# Altium project iMX6_Pixhawk.PrjPcb (part 4 of 6)

## Sheet [14] - PWR 5V, 3V3, 2V5.SchDoc
size A2; DocumentNumber: 14; SheetNumber: 14; SheetTotal: 18
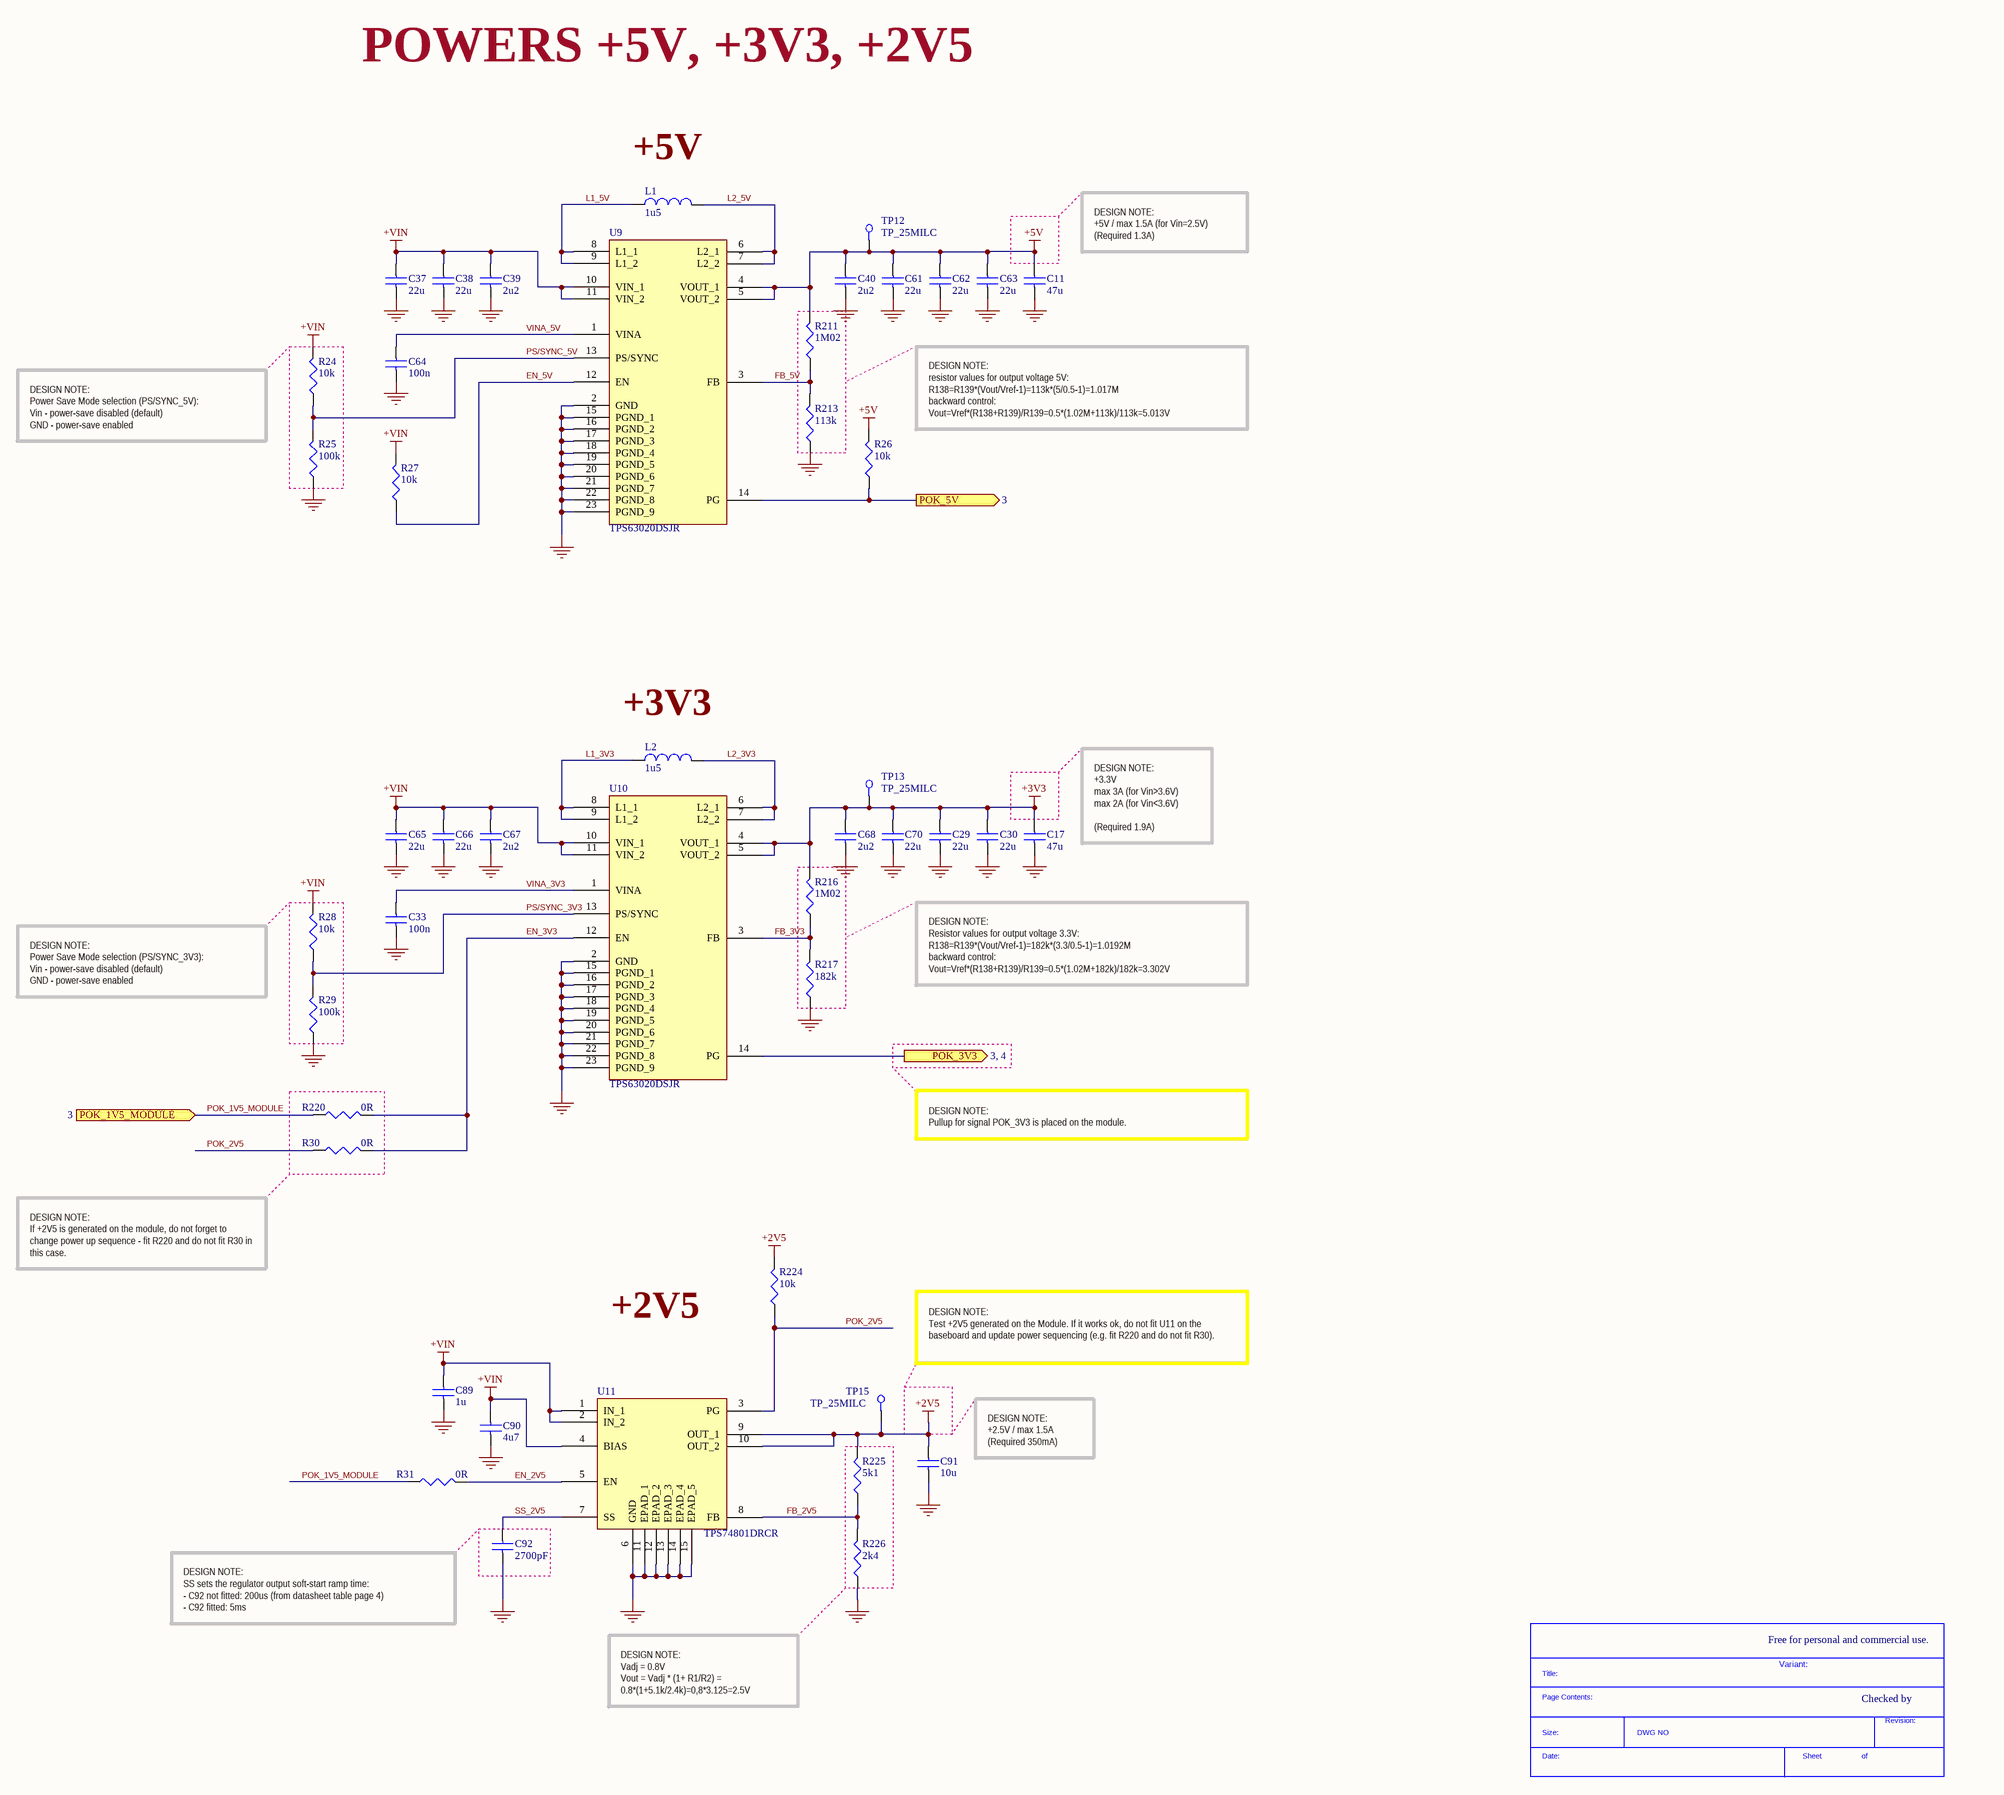
[diagram p16: [14] - PWR 5V, 3V3, 2V5.SchDoc]

### Parts
(Parts that share a designator on the sheet are numbered #1, #2 ... from top to bottom, then left to right.)
*#11  SDTitleBlock  (value not drawn)  (graphical)
C11  47u  [C0805]
C17  47u  [C0805]
C29  22u  [C0603]
C30  22u  [C0603]
C33  100n  [C0402]
C37  22u  [C0603]
C38  22u  [C0603]
C39  2u2  [C0402]
C40  2u2  [C0402]
C61  22u  [C0603]
C62  22u  [C0603]
C63  22u  [C0603]
C64  100n  [C0402]
C65  22u  [C0603]
C66  22u  [C0603]
C67  2u2  [C0402]
C68  2u2  [C0402]
C70  22u  [C0603]
C89  1u  [C0402]
C90  4u7  [C0402]
C91  10u  [C0603]
C92  2700pF  [C0402]
L1  1u5  [IHLP_204MILX216MIL]
L2  1u5  [IHLP_204MILX216MIL]
R24  10k  [R0402]
R25  100k  [R0402]
R26  10k  [R0402]
R27  10k  [R0402]
R28  10k  [R0402]
R29  100k  [R0402]
R30  0R  [R0402]
R31  0R  [R0402]
R211  1M02  [R0402]
R213  113k  [R0402]
R216  1M02  [R0402]
R217  182k  [R0402]
R220  0R  [R0402]
R224  10k  [R0402]
R225  5k1  [R0402]
R226  2k4  [R0402]
TP12  TP_25MILC  [TP_25C]  (no BOM)
TP13  TP_25MILC  [TP_25C]  (no BOM)
TP15  TP_25MILC  [TP_25C]  (no BOM)
U9  TPS63020DSJR  [DSJ (R-PVSON-N14)]
U10  TPS63020DSJR  [DSJ (R-PVSON-N14)]
U11  TPS74801DRCR  [DRC (S-PVSON-N10)]

### Ports
POK_1V5_MODULE (in, see 3), POK_3V3 (see 3, 4), POK_5V (out, see 3)

### Nets
+2V5: C91.1 R224.2 R225.2 TP15.1 U11.9(OUT_1) U11.10(OUT_2)
+3V3: C17.1 C29.1 C30.1 C68.1 C70.1 R216.2 TP13.1 U10.4(VOUT_1) U10.5(VOUT_2)
+5V: C11.1 C40.1 C61.1 C62.1 C63.1 R26.2 R211.2 TP12.1 U9.4(VOUT_1) U9.5(VOUT_2)
+VIN: C37.1 C38.1 C39.1 C65.1 C66.1 C67.1 C89.1 C90.1 R24.2 R27.2 R28.2 U9.10(VIN_1) U9.11(VIN_2) U10.10(VIN_1) U10.11(VIN_2) U11.1(IN_1) U11.2(IN_2) U11.4(BIAS)
GND: C11.2 C17.2 C29.2 C30.2 C33.2 C37.2 C38.2 C39.2 C40.2 C61.2 C62.2 C63.2 C64.2 C65.2 C66.2 C67.2 C68.2 C70.2 C89.2 C90.2 C91.2 C92.2 R25.1 R29.1 R213.1 R217.1 R226.1 U9.2(GND) U9.15(PGND_1) U9.16(PGND_2) U9.17(PGND_3) U9.18(PGND_4) U9.19(PGND_5) U9.20(PGND_6) U9.21(PGND_7) U9.22(PGND_8) U9.23(PGND_9) U10.2(GND) U10.15(PGND_1) U10.16(PGND_2) U10.17(PGND_3) U10.18(PGND_4) U10.19(PGND_5) U10.20(PGND_6) U10.21(PGND_7) U10.22(PGND_8) U10.23(PGND_9) U11.6(GND) U11.11(EPAD_1) U11.12(EPAD_2) U11.13(EPAD_3) U11.14(EPAD_4) U11.15(EPAD_5)
EN_2V5: R31.2 U11.5(EN)
EN_3V3: R30.2 R220.2 U10.12(EN)
EN_5V: R27.1 U9.12(EN)
FB_2V5: R225.1 R226.2 U11.8(FB)
FB_3V3: R216.1 R217.2 U10.3(FB)
FB_5V: R211.1 R213.2 U9.3(FB)
L1_3V3: L2.1 U10.8(L1_1) U10.9(L1_2)
L1_5V: L1.1 U9.8(L1_1) U9.9(L1_2)
L2_3V3: L2.2 U10.6(L2_1) U10.7(L2_2)
L2_5V: L1.2 U9.6(L2_1) U9.7(L2_2)
POK_1V5_MODULE: R31.1 R220.1 ; port POK_1V5_MODULE
POK_2V5: R30.1 R224.1 U11.3(PG)
PS/SYNC_3V3: R28.1 R29.2 U10.13(PS/SYNC)
PS/SYNC_5V: R24.1 R25.2 U9.13(PS/SYNC)
SS_2V5: C92.1 U11.7(SS)
VINA_3V3: C33.1 U10.1(VINA)
VINA_5V: C64.1 U9.1(VINA)
NetJ2_7: R26.1 U9.14(PG) ; port POK_5V
NetJ2_9: U10.14(PG) ; port POK_3V3

### Notes on the sheet
- POWERS +5V, +3V3, +2V5
- (near L1) +5V
- DESIGN NOTE:
  +5V / max 1.5A (for Vin=2.5V)
  (Required 1.3A)
- DESIGN NOTE:
  Power Save Mode selection (PS/SYNC_5V):
  Vin - power-save disabled (default)
  GND - power-save enabled
- DESIGN NOTE:
  resistor values for output voltage 5V:
  R138=R139*(Vout/Vref-1)=113k*(5/0.5-1)=1.017M
  backward control:
  Vout=Vref*(R138+R139)/R139=0.5*(1.02M+113k)/113k=5.013V
- (near L2) +3V3
- DESIGN NOTE:
  +3.3V
  max 3A (for Vin>3.6V)
  max 2A (for Vin<3.6V)
  (Required 1.9A)
- DESIGN NOTE:
  Power Save Mode selection (PS/SYNC_3V3):
  Vin - power-save disabled (default)
  GND - power-save enabled
- DESIGN NOTE:
  Resistor values for output voltage 3.3V:
  R138=R139*(Vout/Vref-1)=182k*(3.3/0.5-1)=1.0192M
  backward control:
  Vout=Vref*(R138+R139)/R139=0.5*(1.02M+182k)/182k=3.302V
- DESIGN NOTE:
  Pullup for signal POK_3V3 is placed on the module.
- DESIGN NOTE:
  If +2V5 is generated on the module, do not forget to change power up sequence - fit R220 and do not fit R30 in this case.
- +2V5
- DESIGN NOTE:
  Test +2V5 generated on the Module. If it works ok, do not fit U11 on the baseboard and update power sequencing (e.g. fit R220 and do not fit R30).
- DESIGN NOTE:
  +2.5V / max 1.5A
  (Required 350mA)
- DESIGN NOTE:
  SS sets the regulator output soft-start ramp time:
  - C92 not fitted: 200us (from datasheet table page 4)
  - C92 fitted: 5ms
- Free for personal and commercial use.
- DESIGN NOTE:
  Vadj = 0.8V
  Vout = Vadj * (1+ R1/R2) = 0.8*(1+5.1k/2.4k)=0,8*3.125=2.5V
- Variant:
- Checked by
- (in symbol SDTitleBlock) Title:; Page Contents:; Revision:; Size:; DWG NO; Date:; Sheet; of

### Library data of the parts
C11 C17 = JMK212BJ476MG-T: CAP CER 47UF 6.3V 20% X5R 0805; Manufacturer: Taiyo Yuden; Capacitance: 47µF; .Creator: MM; Supplier 1: Digi-Key; Manufacturer Part Number: JMK212BJ476MG-T; RoHS: RoHS Compliant; Category: Capacitors; Stock 1: 34061; Pricing 1: 1=0.77, 10=0.737, 50=0.44, 100=0.3575, 250=0.297, 500=0.2695, 1000=0.2475 (USD); Packaging: Cut Tape (CT); Tolerance: ±20%; Voltage - Rated: 6.3V; Temperature Coefficient: X5R; Mounting Type: Surface Mount, MLCC; Operating Temperature: -55°C ~ 85°C; Applications: General Purpose; Ratings: -; Package / Case: 0805 (2012 Metric); Size / Dimension: 0.079" L x 0.049" W (2.00mm x 1.25mm); Height - Seated (Max): -; Thickness (Max): 0.053" (1.35mm); Lead Spacing: -; Features: -; Lead Style: -; ComponentLink1URL: http://www.yuden.co.jp/productdata/catalog/en/mlcc_all_e.pdf; ComponentLink1Description: http://www.yuden.co.jp/productdata/catalog/en/mlcc_all_e.pdf; Supplier Part Number 1: 587-1779-1-ND; .Checked SCH: MM; .Checked PCB: MM
C29 C30 C37 C38 C61-C63 C65 C66 C70 = C1608X5R0J226M080AC: CAP CER 22UF 6.3V 20% X5R 0603; Manufacturer: TDK Corporation; Capacitance: 22µF; .Creator: MM; Supplier 1: Digi-Key; Manufacturer Part Number: C1608X5R0J226M080AC; RoHS: RoHS Compliant; Category: Capacitors; Stock 1: 593047; Pricing 1: 1=0.39, 10=0.343, 100=0.1714, 250=0.13708, 500=0.12484, 1000=0.1104 (USD); Packaging: Cut Tape (CT); Tolerance: ±20%; Voltage - Rated: 6.3V; Temperature Coefficient: X5R; Mounting Type: Surface Mount, MLCC; Operating Temperature: -55°C ~ 85°C; Applications: General Purpose; Ratings: -; Package / Case: 0603 (1608 Metric); Size / Dimension: 0.063" L x 0.031" W (1.60mm x 0.80mm); Height - Seated (Max): -; Thickness (Max): 0.039" (1.00mm); Lead Spacing: -; Features: -; Lead Style: -; ComponentLink1URL: http://product.tdk.com/en/catalog/datasheets/mlcc_commercial_general_en.pdf; ComponentLink1Description: http://product.tdk.com/en/catalog/datasheets/mlcc_commercial_general_en.pdf; Supplier Part Number 1: 445-8028-1-ND; .Checked PCB: MM; .Checked SCH: MM
C33 C64 = C1005X5R1H104K: as C26 on sheet [09] - USB; Category: Capacitors; Supplier Part Number: 445-5942-1-ND; Manufacturer Part Number: C1005X5R1H104K; Operating Temperature: -55°C ~ 85°C; Package / Case: 0402 (1005 Metric); Price 1k [$]: 0.02340; .Checked SCH: used; Voltage - Rated: 50V; Supplier: Digikey; Supplier 1: Digi-Key; Supplier Part Number 1: 445-5942-1-ND; RoHS: RoHS Compliant; Stock 1: 106926; Pricing 1: 1=0.27, 10=0.18, 100=0.072, 250=0.05176, 500=0.0369, 1000=0.027 (USD); Tolerance: ±10%; Temperature Coefficient: X5R; Mounting Type: Surface Mount, MLCC; Applications: General Purpose; Ratings: -; Size / Dimension: 0.039" L x 0.020" W (1.00mm x 0.50mm); Height - Seated (Max): -; Thickness (Max): 0.022" (0.55mm); Lead Spacing: -; Features: -; Packaging: Cut Tape (CT); Lead Style: -; ComponentLink1URL: http://www.tdk.co.jp/tefe02/e412_c.pdf; ComponentLink1Description: http://www.tdk.co.jp/tefe02/e412_c.pdf
C39 C40 C67 C68 = C1005X5R1A225K: CAP CER 2.2UF 10V 10% X5R 0402; Manufacturer: TDK Corporation; Capacitance: 2.2µF; .Checked PCB: used; Supplier 1: Digi-Key; Supplier Part Number 1: 445-7392-1-ND; Manufacturer Part Number: C1005X5R1A225K; RoHS: RoHS Compliant; Category: Capacitors; Stock 1: 22891; Pricing 1: 1=0.42, 10=0.332, 100=0.2, 250=0.15, 500=0.128, 1000=0.1 (USD); Voltage - Rated: 10V; Tolerance: ±10%; Temperature Coefficient: X5R; Mounting Type: Surface Mount, MLCC; Operating Temperature: -55°C ~ 85°C; Applications: General Purpose; Ratings: -; Package / Case: 0402 (1005 Metric); Size / Dimension: 0.039" L x 0.020" W (1.00mm x 0.50mm); Height - Seated (Max): -; Thickness (Max): 0.022" (0.55mm); Lead Spacing: -; Features: -; Packaging: Cut Tape (CT); Lead Style: -; ComponentLink1URL: http://www.tdk.com/pdf/general_B11.pdf; ComponentLink1Description: http://www.tdk.com/pdf/general_B11.pdf; .Checked SCH: used
C89 = C1005X5R1C105K: CAP CER 1.0UF 16V X5R 0402; Manufacturer: TDK Corporation; Capacitance: 1.0µF; Value: 1uF; .Checked PCB: used; Tolerance: ±10%; Category: Capacitors; Supplier Part Number: 445-4978-1-ND; Manufacturer Part Number: C1005X5R1C105K; Operating Temperature: -55°C ~ 85°C; Package / Case: 0402 (1005 Metric); Price 1k [$]: 0.02080; .Checked SCH: used; Voltage - Rated: 16V; Supplier: Digikey; Supplier 1: Digi-Key; Supplier Part Number 1: 445-4978-1-ND; RoHS: RoHS Compliant; Stock 1: 341010; Pricing 1: 1=0.24, 10=0.16, 100=0.064, 250=0.046, 500=0.0328, 1000=0.024 (USD); Temperature Coefficient: X5R; Mounting Type: Surface Mount, MLCC; Applications: General Purpose; Ratings: -; Size / Dimension: 0.039" L x 0.020" W (1.00mm x 0.50mm); Height - Seated (Max): -; Thickness (Max): 0.022" (0.55mm); Lead Spacing: -; Features: -; Packaging: Cut Tape (CT); Lead Style: -; ComponentLink1URL: http://www.tdk.co.jp/tefe02/e412_c.pdf; ComponentLink1Description: http://www.tdk.co.jp/tefe02/e412_c.pdf
C90 = C1005X5R1A475M: CAP CER 4.7UF 10V 20% X5R 0402; Manufacturer: TDK Corporation; Capacitance: 4.7µF; .Checked PCB: used; Supplier 1: Digi-Key; Supplier Part Number 1: 445-8023-1-ND; Manufacturer Part Number: C1005X5R1A475M; RoHS: RoHS Compliant; Category: Capacitors; Stock 1: 10140; Pricing 1: 1=0.53, 10=0.415, 100=0.25, 250=0.18752, 500=0.16, 1000=0.125, 5000=0.095 (USD); Voltage - Rated: 10V; Tolerance: ±20%; Temperature Coefficient: X5R; Mounting Type: Surface Mount, MLCC; Operating Temperature: -55°C ~ 85°C; Applications: General Purpose; Ratings: -; Package / Case: 0402 (1005 Metric); Size / Dimension: 0.039" L x 0.020" W (1.00mm x 0.50mm); Height - Seated (Max): -; Thickness (Max): -; Lead Spacing: -; Features: -; Packaging: Cut Tape (CT); Lead Style: -; ComponentLink1URL: http://www.tdk.com/pdf/general_B11.pdf; ComponentLink1Description: http://www.tdk.com/pdf/general_B11.pdf; .Checked SCH: used
C91 = C1608X5R0J106M: CAP CER 10UF 6.3V X5R 20% 0603; Manufacturer: TDK Corporation; Capacitance: 10µF; Value: 10µF; .Checked PCB: used; Category: Capacitors; Supplier Part Number: 445-4112-1-ND; Manufacturer Part Number: C1608X5R0J106M; Operating Temperature: -55°C ~ 85°C; Package / Case: 0603 (1608 Metric); Price 1k [$]: 0.08580; .Checked SCH: used; Voltage - Rated: 6.3V; Features: Low ESR; Supplier: Digikey; Supplier 1: Digi-Key; Supplier Part Number 1: 445-4112-1-ND; RoHS: RoHS Compliant; Stock 1: 48157; Pricing 1: 1=0.46, 10=0.363, 100=0.1898, 250=0.14024, 500=0.1089, 1000=0.0858 (USD); Tolerance: ±20%; Temperature Coefficient: X5R; Mounting Type: Surface Mount, MLCC; Applications: General Purpose; Ratings: -; Size / Dimension: 0.063" L x 0.031" W (1.60mm x 0.80mm); Height - Seated (Max): -; Thickness (Max): 0.037" (0.95mm); Lead Spacing: -; Packaging: Cut Tape (CT); Lead Style: -; ComponentLink1URL: http://www.tdk.com/pdf/general_B11.pdf; ComponentLink1Description: http://www.tdk.com/pdf/general_B11.pdf
C92 = GRM155R71H272KA01D: CAP CER 2700PF 50V 10% X7R 0402; Manufacturer: Murata Electronics North America; .Checked PCB: used; Supplier 1: Digi-Key; Supplier Part Number 1: 490-1306-1-ND; Manufacturer Part Number: GRM155R71H272KA01D; RoHS: RoHS Compliant; Category: Capacitors; Stock 1: 38160; Pricing 1: 10=0.01, 50=0.0086, 100=0.0074, 250=0.00664, 500=0.00618, 750=0.00571, 1000=0.00542 (USD); Capacitance: 2700pF; Voltage - Rated: 50V; Tolerance: ±10%; Temperature Coefficient: X7R; Mounting Type: Surface Mount, MLCC; Operating Temperature: -55°C ~ 125°C; Applications: General Purpose; Ratings: -; Package / Case: 0402 (1005 Metric); Size / Dimension: 0.039" L x 0.020" W (1.00mm x 0.50mm); Height - Seated (Max): -; Thickness (Max): 0.022" (0.55mm); Lead Spacing: -; Features: -; Packaging: Cut Tape (CT); Lead Style: -; ComponentLink1URL: http://search.murata.co.jp/Ceramy/image/img/PDF/ENG/GRM155R71H272KA01.pdf; ComponentLink1Description: http://search.murata.co.jp/Ceramy/image/img/PDF/ENG/GRM155R71H272KA01.pdf; .Checked SCH: used
L1 L2 = IHLP2020CZER1R5M11: FIXED IND 1.5UH 7.5A 18.5 MOHM; Manufacturer: Vishay Dale; Type: Molded; Inductance: 1.5µH; Tolerance: ±20%; Current - Saturation: 7A; Shielding: Shielded; DC Resistance (DCR): 18.5 mOhm Max; Frequency - Self Resonant: 39MHz; Frequency - Test: 100kHz; .Creator: MM; Supplier 1: Digi-Key; Manufacturer Part Number: IHLP2020CZER1R5M11; RoHS: RoHS Compliant; Category: Inductors, Coils, Chokes; Stock 1: 5892; Pricing 1: 1=2.4, 10=2.24, 100=1.664, 500=1.408, 1000=1.312 (USD); Packaging: Cut Tape (CT); Material - Core: -; Current Rating: 7.5A; Q @ Freq: -; Operating Temperature: -55°C ~ 125°C; Mounting Type: Surface Mount; Package / Case: Non Standard; Size / Dimension: 0.216" L x 0.204" W (5.49mm x 5.18mm); Height - Seated (Max): 0.118" (3.00mm); Supplier Device Package: -; ComponentLink1URL: http://www.vishay.com/docs/34260/lp20cz11.pdf; ComponentLink1Description: http://www.vishay.com/docs/34260/lp20cz11.pdf; Supplier Part Number 1: 541-1235-1-ND; .Checked PCB: MM; .Checked SCH: MM
R24 R26-R28 R224 = RC0402FR-0710KL: as R45 on sheet [09] - USB; Category: Resistors; Supplier Part Number: 311-10.0KLRCT-ND; Manufacturer Part Number: RC0402FR-0710KL; Package / Case: 0402 (1005 Metric); Price 1k [$]: 0.01421; Resistance (Ohms): 10K; Tolerance: ±1%; Value: 10k; .Checked SCH: used; Supplier: Digikey; Supplier 1: Digi-Key; Supplier Part Number 1: 311-10.0KLRCT-ND; RoHS: RoHS Compliant; Stock 1: 2916495; Pricing 1: 10=0.014, 50=0.0104, 100=0.0079, 250=0.00584, 500=0.00432, 1000=0.00288 (USD); Composition: Thick Film; Features: -; Size / Dimension: 0.039" L x 0.020" W (1.00mm x 0.50mm); Height: 0.016" (0.40mm); Number of Terminations: 2; Packaging: Cut Tape (CT); ComponentLink1URL: http://www.yageo.com/documents/recent/PYu-RC0402_51_RoHS_L_6.pdf; ComponentLink1Description: http://www.yageo.com/documents/recent/PYu-RC0402_51_RoHS_L_6.pdf
R25 R29 = RMCF0402FT100K: as R214 on sheet [09] - USB; Category: Resistors; Supplier Part Number: RMCF0402FT100KCT-ND; Manufacturer Part Number: RMCF0402FT100K; Package / Case: 0402 (1005 Metric); Price 1k [$]: 0.00384; Resistance (Ohms): 100K; Tolerance: ±1%; Value: 100k; .Checked SCH: used; Supplier: Digikey; Supplier 1: Digi-Key; Supplier Part Number 1: RMCF0402FT100KCT-ND; RoHS: RoHS Compliant; Stock 1: 95; Pricing 1: 1=0.04, 10=0.025, 50=0.0138, 100=0.0105, 250=0.0078, 500=0.00576, 1000=0.00384 (USD); Composition: Thick Film; Features: -; Size / Dimension: 0.039" L x 0.020" W (1.00mm x 0.50mm); Height: 0.016" (0.40mm); Number of Terminations: 2; Packaging: Cut Tape (CT); ComponentLink1URL: http://www.seielect.com/Catalog/SEI-RMCF.pdf; ComponentLink1Description: http://www.seielect.com/Catalog/SEI-RMCF.pdf
R30 R31 R220 = RC0402JR-070RL: as R63 on sheet [09] - USB; Category: Resistors; Supplier Part Number: 311-0.0JRCT-ND; Manufacturer Part Number: RC0402JR-070RL; Package / Case: 0402 (1005 Metric); Price 1k [$]: 0.01389; Value: 0R; .Checked SCH: used; Supplier: Digikey; Supplier 1: Digi-Key; Supplier Part Number 1: 311-0.0JRCT-ND; RoHS: RoHS Compliant; Stock 1: 1106330; Pricing 1: 10=0.012, 50=0.009, 100=0.0069, 250=0.00512, 500=0.0038, 1000=0.00253 (USD); Composition: Thick Film; Features: -; Temperature Coefficient: -; Size / Dimension: 0.039" L x 0.020" W (1.00mm x 0.50mm); Height: 0.016" (0.40mm); Number of Terminations: 2; Packaging: Cut Tape (CT); ComponentLink1URL: http://www.yageo.com/documents/recent/PYu-RC0402_51_RoHS_L_6.pdf; ComponentLink1Description: http://www.yageo.com/documents/recent/PYu-RC0402_51_RoHS_L_6.pdf
R211 R216 = CRCW04021M02FKED: RES 1.02M OHM 1/16W 1% 0402 SMD; Manufacturer: Vishay Dale; Power (Watts): 0.063W, 1/16W; Temperature Coefficient: ±100ppm/°C; .Creator: MM; Supplier 1: Digi-Key; Manufacturer Part Number: CRCW04021M02FKED; RoHS: RoHS Compliant; Category: Resistors; Stock 1: 38338; Pricing 1: 10=0.083, 50=0.0444, 200=0.0255, 1000=0.0174 (USD); Packaging: Cut Tape (CT); Resistance (Ohms): 1.02M; Tolerance: ±1%; Composition: Thick Film; Features: Automotive AEC-Q200 Qualified; Package / Case: 0402 (1005 Metric); Supplier Device Package: 0402 (1005 Metric); Size / Dimension: 0.039" L x 0.020" W (1.00mm x 0.50mm); Height: 0.016" (0.40mm); Number of Terminations: 2; ComponentLink1URL: http://www.vishay.com/docs/20035/dcrcwe3.pdf; ComponentLink1Description: http://www.vishay.com/docs/20035/dcrcwe3.pdf; Supplier Part Number 1: 541-1.02MLCT-ND; .Checked PCB: MM; .Checked SCH: MM
R213 = CRCW0402113KFKED: RES 113K OHM 1/16W 1% 0402 SMD; Manufacturer: Vishay Dale; Power (Watts): 0.063W, 1/16W; Temperature Coefficient: ±100ppm/°C; .Creator: MM; Supplier 1: Digi-Key; Manufacturer Part Number: CRCW0402113KFKED; RoHS: RoHS Compliant; Category: Resistors; Stock 1: 66504; Pricing 1: 10=0.083, 50=0.0444, 200=0.0255, 1000=0.0174 (USD); Packaging: Cut Tape (CT); Resistance (Ohms): 113k; Tolerance: ±1%; Composition: Thick Film; Features: Automotive AEC-Q200 Qualified; Package / Case: 0402 (1005 Metric); Supplier Device Package: 0402 (1005 Metric); Size / Dimension: 0.039" L x 0.020" W (1.00mm x 0.50mm); Height: 0.016" (0.40mm); Number of Terminations: 2; ComponentLink1URL: http://www.vishay.com/docs/20035/dcrcwe3.pdf; ComponentLink1Description: http://www.vishay.com/docs/20035/dcrcwe3.pdf; Supplier Part Number 1: 541-113KLCT-ND; .Checked PCB: MM; .Checked SCH: MM
R217 = CRCW0402182KFKED: RES 182K OHM 1/16W 1% 0402 SMD; Manufacturer: Vishay Dale; Power (Watts): 0.063W, 1/16W; Temperature Coefficient: ±100ppm/°C; .Creator: MM; Supplier 1: Digi-Key; Manufacturer Part Number: CRCW0402182KFKED; RoHS: RoHS Compliant; Category: Resistors; Stock 1: 98035; Pricing 1: 10=0.083, 50=0.0444, 200=0.0255, 1000=0.0174 (USD); Packaging: Cut Tape (CT); Resistance (Ohms): 182k; Tolerance: ±1%; Composition: Thick Film; Features: Automotive AEC-Q200 Qualified; Package / Case: 0402 (1005 Metric); Supplier Device Package: 0402 (1005 Metric); Size / Dimension: 0.039" L x 0.020" W (1.00mm x 0.50mm); Height: 0.016" (0.40mm); Number of Terminations: 2; ComponentLink1URL: http://www.vishay.com/docs/20035/dcrcwe3.pdf; ComponentLink1Description: http://www.vishay.com/docs/20035/dcrcwe3.pdf; Supplier Part Number 1: 541-182KLCT-ND; .Checked PCB: MM; .Checked SCH: MM
R225 = RC0402FR-075K1L: RES 5.10K OHM 1/16W 1% 0402 SMD; Manufacturer: Yageo; Resistance (Ohms): 5.1K; Power (Watts): 0.063W, 1/16W; .Checked PCB: RF; Temperature Coefficient: ±100ppm/°C; Category: Resistors; Supplier Part Number: 311-5.10KLRCT-ND; Manufacturer Part Number: RC0402FR-075K1L; Package / Case: 0402 (1005 Metric); Price 1k [$]: 0.00288; Tolerance: ±1%; Value: 5k1; .Checked SCH: RF; Supplier: Digikey; Supplier 1: Digi-Key; Supplier Part Number 1: 311-5.10KLRCT-ND; RoHS: RoHS Compliant; Stock 1: 571594; Pricing 1: 10=0.014, 50=0.0104, 100=0.0079, 250=0.00584, 500=0.00432, 1000=0.00288 (USD); Composition: Thick Film; Features: -; Size / Dimension: 0.039" L x 0.020" W (1.00mm x 0.50mm); Height: 0.016" (0.40mm); Number of Terminations: 2; Packaging: Cut Tape (CT); ComponentLink1URL: http://www.yageo.com/documents/recent/PYu-RC0402_51_RoHS_L_6.pdf; ComponentLink1Description: http://www.yageo.com/documents/recent/PYu-RC0402_51_RoHS_L_6.pdf
R226 = CRCW04022K40FKED: RES 2.40K OHM 1/16W 1% 0402 SMD; Manufacturer: Vishay Dale; Resistance (Ohms): 2.4K; Power (Watts): 0.063W, 1/16W; Temperature Coefficient: ±100ppm/°C; .Checked PCB: used; Supplier 1: Digi-Key; Supplier Part Number 1: 541-2.40KLCT-ND; Manufacturer Part Number: CRCW04022K40FKED; RoHS: RoHS Compliant; Category: Resistors; Stock 1: 43967; Pricing 1: 10=0.083, 50=0.0444, 200=0.0255, 1000=0.0174 (USD); Composition: Thick Film; Features: -; Tolerance: ±1%; Package / Case: 0402 (1005 Metric); Size / Dimension: 0.039" L x 0.020" W (1.00mm x 0.50mm); Height: 0.016" (0.40mm); Number of Terminations: 2; Packaging: Cut Tape (CT); ComponentLink1URL: http://www.vishay.com/doc?20035; ComponentLink1Description: http://www.vishay.com/doc?20035; .Checked SCH: used
TP12 TP13 TP15 = TP_25MILC: Test Point 25mil
U9 U10 = TPS63020DSJR: IC REG BUCK BST SYNC ADJ 14VSON; Manufacturer: Texas Instruments; Output Type: Adjustable; Number of Outputs: 1; Voltage - Output: 1.2 V ~ 5.5 V; Voltage - Input: 1.8 V ~ 5.5 V; Frequency - Switching: 2.4MHz; Current - Output: 3A; Synchronous Rectifier: Yes; .Creator: MM; Supplier 1: Digi-Key; Manufacturer Part Number: TPS63020DSJR; RoHS: RoHS Compliant; Category: Integrated Circuits (ICs); Stock 1: 3608; Pricing 1: 1=4.92, 10=4.412, 25=3.9672, 100=3.6081, 250=3.26612, 500=2.9241, 750=2.65051, 1000=2.1375 (USD); Packaging: Cut Tape (CT); Type: Step-Down (Buck), Step-Up (Boost); Operating Temperature: -40°C ~ 85°C; Mounting Type: Surface Mount; Package / Case: 14-VFDFN Exposed Pad; Supplier Device Package: 14-VSON (4x3); ComponentLink1URL: http://www.ti.com/lit/ds/symlink/tps63020.pdf; ComponentLink1Description: http://www.ti.com/lit/ds/symlink/tps63020.pdf; Supplier Part Number 1: 296-36491-1-ND; .Checked PCB: MM; .Checked SCH: MM
U11 = TPS74801DRCR: IC REG LDO ADJ 1.5A 10SON; Manufacturer: Texas Instruments; Number of Regulators: 1; Regulator Topology: Positive Adjustable; Voltage - Input: 0.8 V ~ 5.5 V; Voltage - Output: 0.8 V ~ 3.6 V; Voltage - Dropout (Typical): 0.06V @ 1.5A; Current - Output: 1.5A (Max); Current - Limit (Min): 2A; .Creator: MM; .Checked PCB: used; Supplier 1: Digi-Key; Manufacturer Part Number: TPS74801DRCR; RoHS: RoHS Compliant; Category: Integrated Circuits (ICs); Stock 1: 11680; Pricing 1: 1=2.3, 10=2.074, 25=1.8576, 100=0.972, 250=0.954, 500=0.936, 750=0.918 (USD); Packaging: Cut Tape (CT); Operating Temperature: -40°C ~ 125°C; Mounting Type: Surface Mount; Package / Case: 10-VFDFN Exposed Pad; Supplier Device Package: 10-SON (3x3); ComponentLink1URL: http://www.ti.com/lit/ds/symlink/tps74801.pdf; ComponentLink1Description: http://www.ti.com/lit/ds/symlink/tps74801.pdf; Supplier Part Number 1: 296-21563-1-ND; .Checked SCH: used

## Sheet [15] - PWR IN, LEDS, BUTTONS, MECH.SchDoc
size A2; DocumentNumber: 15; SheetNumber: 15; SheetTotal: 18
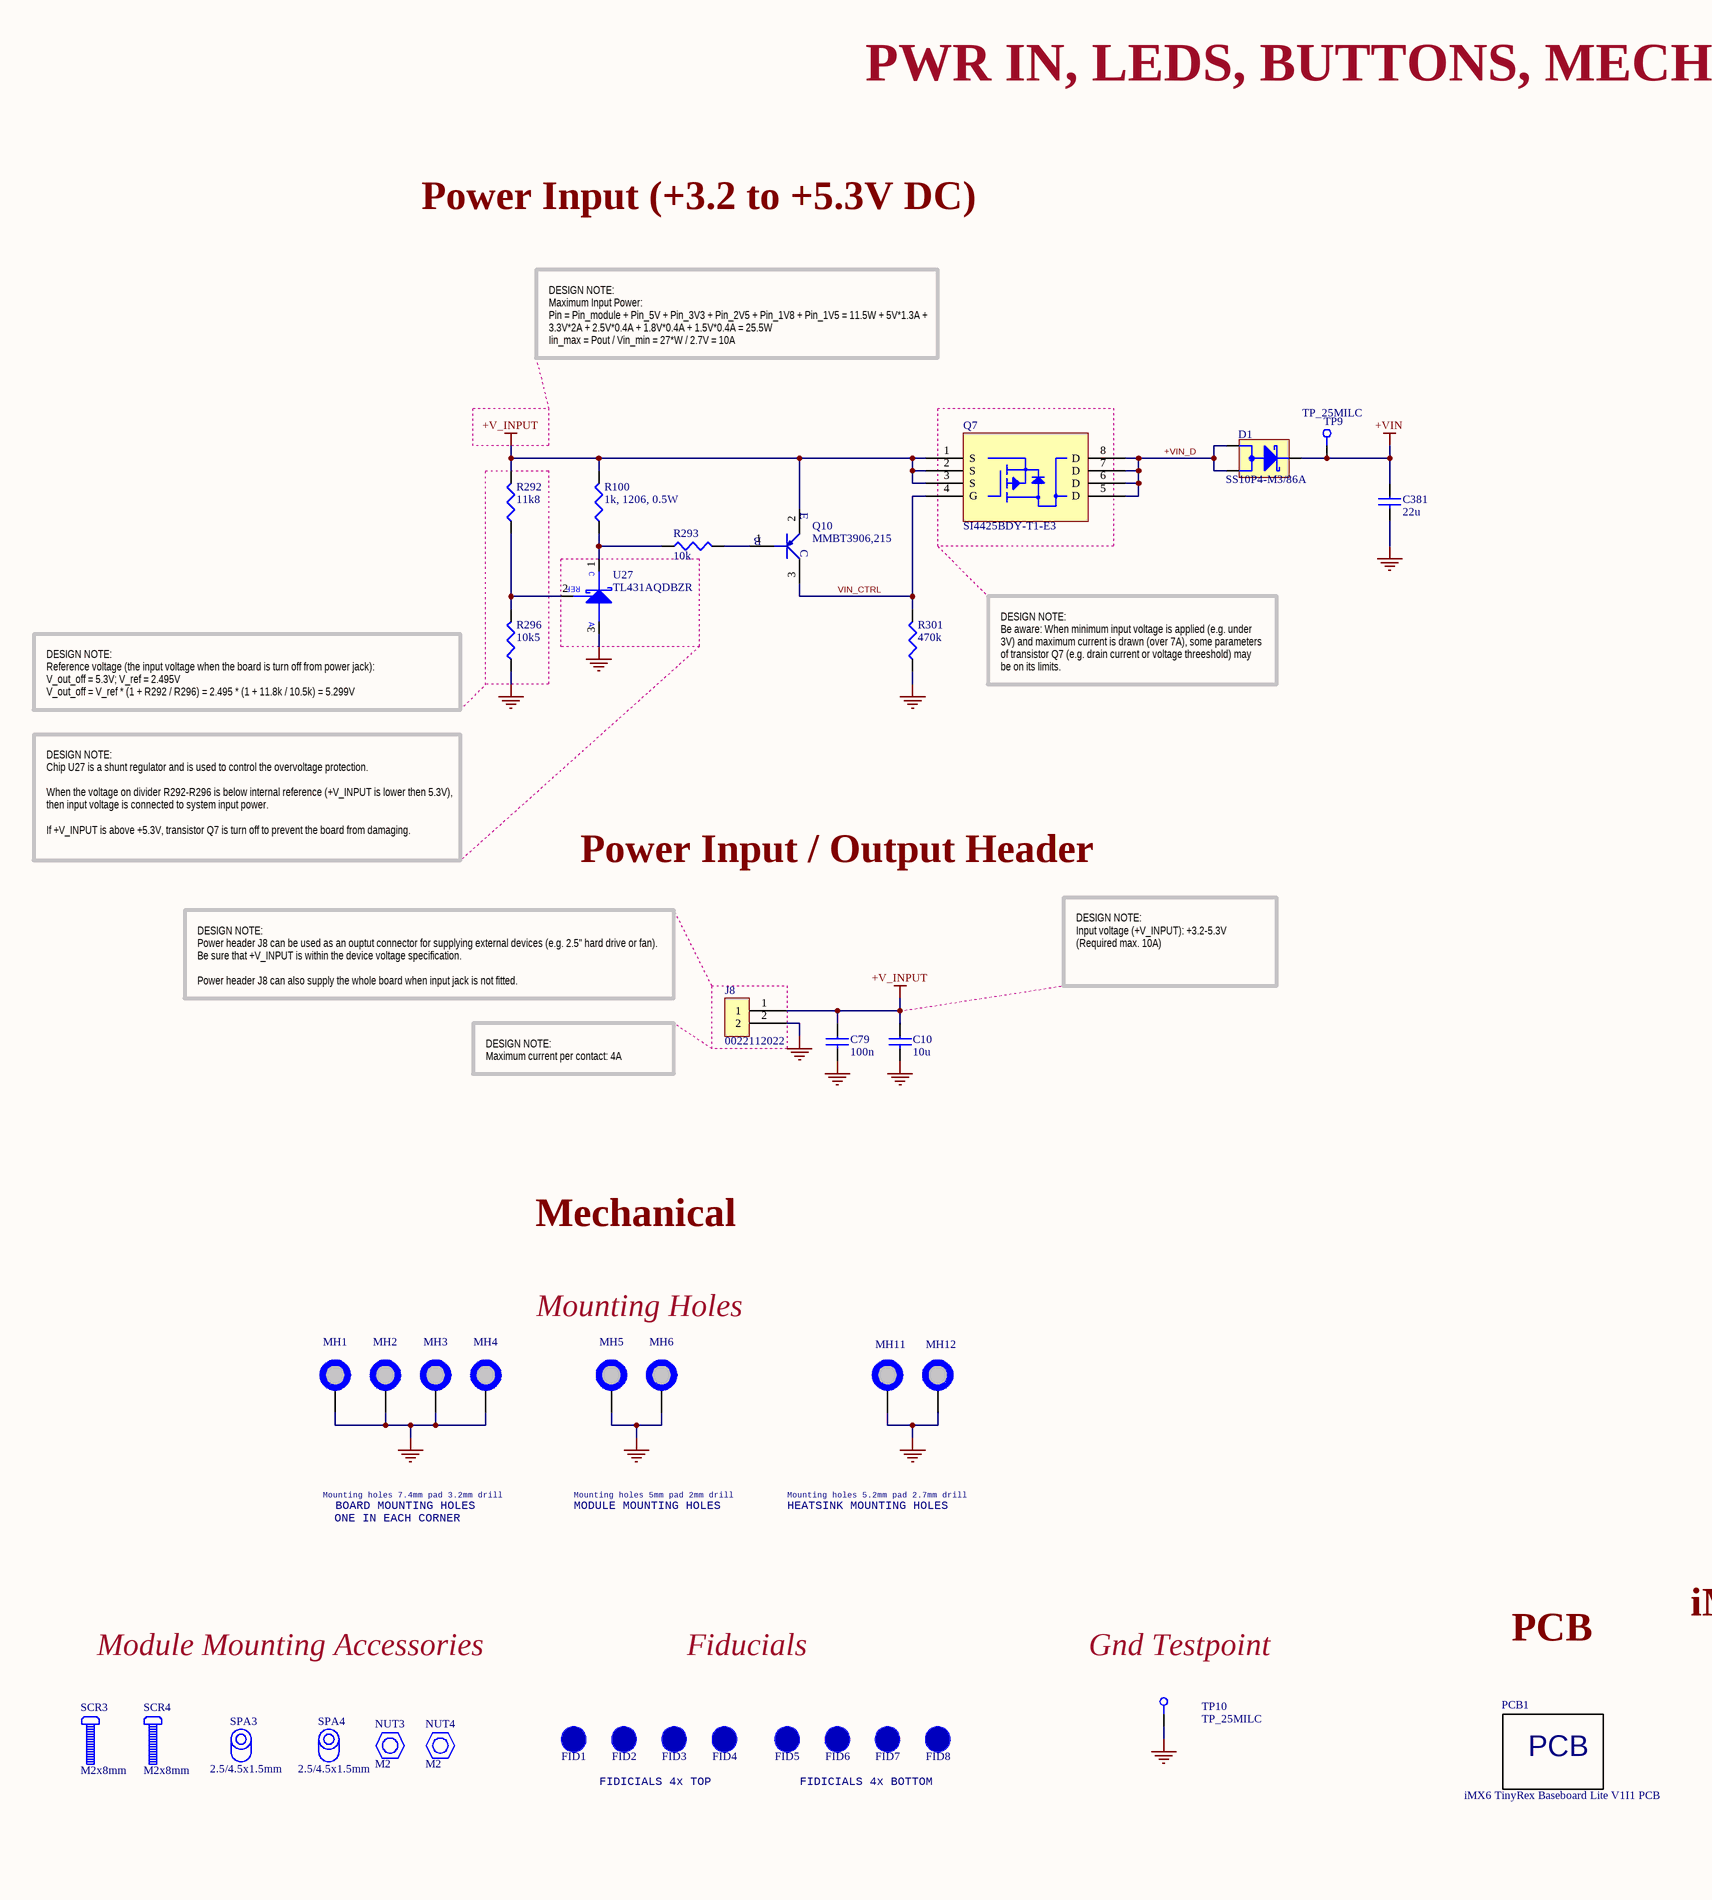
[diagram p17: [15] - PWR IN, LEDS, BUTTONS, MECH.SchDoc, left]
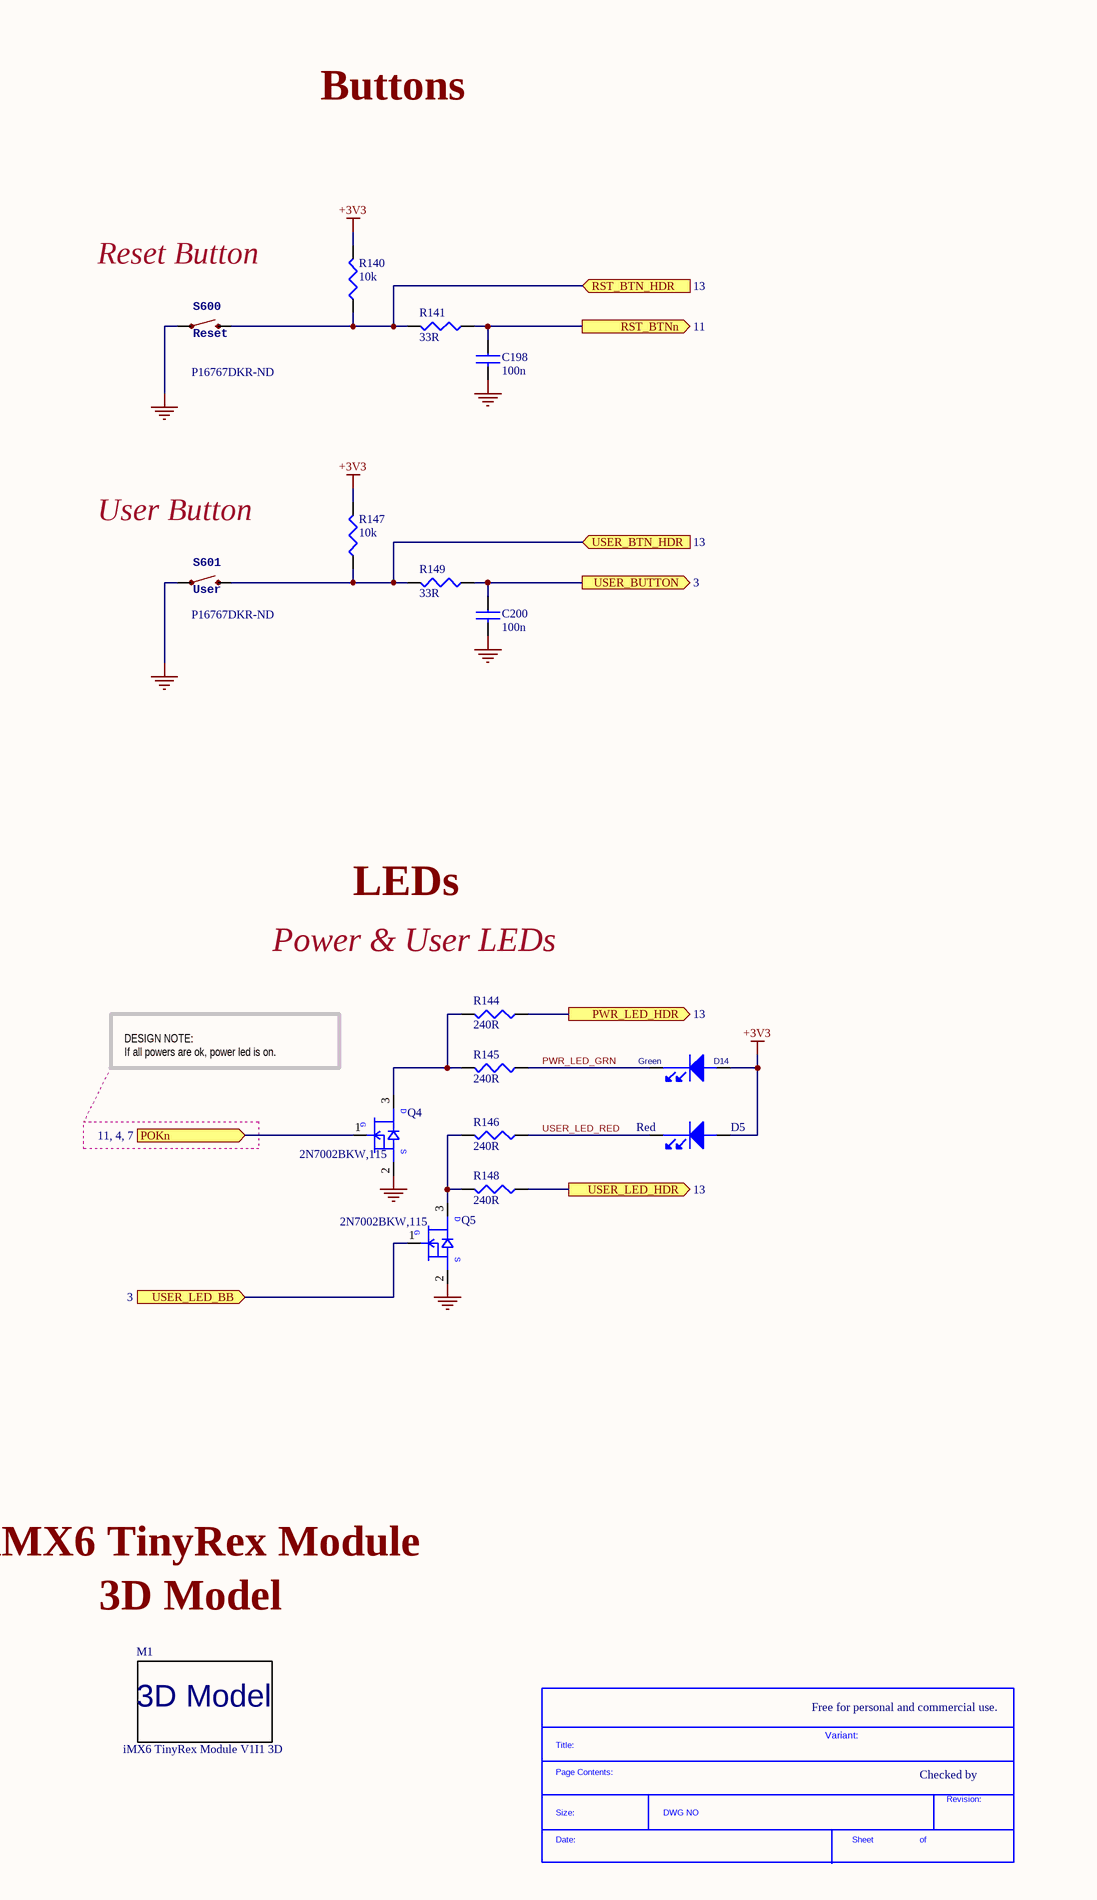
[diagram p18: [15] - PWR IN, LEDS, BUTTONS, MECH.SchDoc, right]

### Parts
(Parts that share a designator on the sheet are numbered #1, #2 ... from top to bottom, then left to right.)
*#12  SDTitleBlock  (value not drawn)  (graphical)
C10  10u  [C0603]
C79  100n  [C0402]
C198  100n  [C0402]
C200  100n  [C0402]
C381  22u  [C0603]
D1  SS10P4-M3/86A  [TO-277A (SMPC)]
D5  Red  [LED_0603]
D14  Green  [LED_0603]
FID1  FID_1MMC  [FID_40X120D]  (value not drawn)  (no BOM)
FID2  FID_1MMC  [FID_40X120D]  (value not drawn)  (no BOM)
FID3  FID_1MMC  [FID_40X120D]  (value not drawn)  (no BOM)
FID4  FID_1MMC  [FID_40X120D]  (value not drawn)  (no BOM)
FID5  FID_1MMC  [FID_40X120D]  (value not drawn)  (no BOM)
FID6  FID_1MMC  [FID_40X120D]  (value not drawn)  (no BOM)
FID7  FID_1MMC  [FID_40X120D]  (value not drawn)  (no BOM)
FID8  FID_1MMC  [FID_40X120D]  (value not drawn)  (no BOM)
J8  0022112022  [HDR_1x2_2.54MM_MOLEX_KK]
M1  iMX6 TinyRex Module V1I1 3D  [iMX6 TinyRex Module 3D]  (no BOM)
MH1  MH_7.4MMC_3.2MMD  [MH_7.4MMD_3.2MMD]  (value not drawn)  (no BOM)
MH2  MH_7.4MMC_3.2MMD  [MH_7.4MMD_3.2MMD]  (value not drawn)  (no BOM)
MH3  MH_7.4MMC_3.2MMD  [MH_7.4MMD_3.2MMD]  (value not drawn)  (no BOM)
MH4  MH_7.4MMC_3.2MMD  [MH_7.4MMD_3.2MMD]  (value not drawn)  (no BOM)
MH5  MH_5MMC_2MMD  [MH_5MMD_2MMD]  (value not drawn)  (no BOM)
MH6  MH_5MMC_2MMD  [MH_5MMD_2MMD]  (value not drawn)  (no BOM)
MH11  MH_5.2MMC_2.7MMD  [MH_5.2MMD_2.7MMD]  (value not drawn)  (no BOM)
MH12  MH_5.2MMC_2.7MMD  [MH_5.2MMD_2.7MMD]  (value not drawn)  (no BOM)
NUT3  M2  [NUT A4 SS M2]
NUT4  M2  [NUT A4 SS M2]
PCB1  iMX6 TinyRex Baseboard Lite V1I1 PCB  (mechanical)
Q4  2N7002BKW,115  [SC70_SOT323]
Q5  2N7002BKW,115  [SC70_SOT323]
Q7  SI4425BDY-T1-E3  [8_SOIC_3.9MM]
Q10  MMBT3906,215  [SOT-23-3-123]
R100  1k, 1206, 0.5W  [R1206]
R140  10k  [R0402]
R141  33R  [R0402]
R144  240R  [R0402]
R145  240R  [R0402]
R146  240R  [R0402]
R147  10k  [R0402]
R148  240R  [R0402]
R149  33R  [R0402]
R292  11k8  [R0402]
R293  10k  [R0402]
R296  10k5  [R0402]
R301  470k  [R0402]
S600  Reset  Supplier Part Number 1: P16767DKR-ND  [EVQP7J01K]
S601  User  Supplier Part Number 1: P16767DKR-ND  [EVQP7J01K]
SCR3  M2x8mm  [SCREW M2x8]
SCR4  M2x8mm  [SCREW M2x8]
SPA3  2.5/4.5x1.5mm  [SPACER 2.5/4.5X1.5MM]
SPA4  2.5/4.5x1.5mm  [SPACER 2.5/4.5X1.5MM]
TP9  TP_25MILC  [TP_25C]  (no BOM)
TP10  TP_25MILC  [TP_25C]  (no BOM)
U27  TL431AQDBZR  [SOT-23-3-123]

### Ports
POKn (see 11, 4, 7), PWR_LED_HDR (out, see 13), RST_BTN_HDR (in, see 13), RST_BTNn (out, see 11), USER_BTN_HDR (in, see 13), USER_BUTTON (out, see 3), USER_LED_BB (in, see 3), USER_LED_HDR (out, see 13)

### Nets
+3V3: D5.2(ANODE) D14.2(ANODE) R140.2 R147.2
+V_INPUT: C10.1 C79.1 J8.1 Q7.1(S) Q7.2(S) Q7.3(S) Q10.2(E) R100.2 R292.2
+VIN: C381.1 D1.3(CATHODE) TP9.1
GND: C10.2 C79.2 C198.2 C200.2 C381.2 J8.2 MH1.1 MH2.1 MH3.1 MH4.1 MH5.1 MH6.1 MH11.1 MH12.1 Q4.2(SOURCE) Q5.2(SOURCE) R296.1 R301.1 S600.A1 S601.A1 TP10.1 U27.3(ANODE)
+VIN_D: D1.1(ANODE1) D1.2(ANODE2) Q7.5(D) Q7.6(D) Q7.7(D) Q7.8(D)
PWR_LED_GRN: D14.1(cathode) R145.1
USER_LED_RED: D5.1(cathode) R146.1
VIN_CTRL: Q7.4(G) Q10.3(C) R301.2
NetC198_1: C198.1 R141.1 ; port RST_BTNn
NetC200_1: C200.1 R149.1 ; port USER_BUTTON
NetJ1_82: Q5.1(GATE) ; port USER_LED_BB
NetQ4_1: Q4.1(GATE) ; port POKn
NetQ4_3: Q4.3(DRAIN) R144.2 R145.2
NetQ5_3: Q5.3(DRAIN) R146.2 R148.2
NetQ10_1: Q10.1(B) R293.2
NetR100_1: R100.1 R293.1 U27.1(cathode)
NetR140_1: R140.1 R141.2 S600.B3 ; port RST_BTN_HDR
NetR144_1: R144.1 ; port PWR_LED_HDR
NetR147_1: R147.1 R149.2 S601.B3 ; port USER_BTN_HDR
NetR148_1: R148.1 ; port USER_LED_HDR
NetR292_1: R292.1 R296.2 U27.2(REF)

### Notes on the sheet
- PWR IN, LEDS, BUTTONS, MECH
- Power Input (+3.2 to +5.3V DC)
- Buttons
- DESIGN NOTE:
  Maximum Input Power:
  Pin = Pin_module + Pin_5V + Pin_3V3 + Pin_2V5 + Pin_1V8 + Pin_1V5 = 11.5W + 5V*1.3A + 3.3V*2A + 2.5V*0.4A + 1.8V*0.4A + 1.5V*0.4A = 25.5W
  Iin_max = Pout / Vin_min = 27*W / 2.7V = 10A
- Reset Button
- DESIGN NOTE:
  Reference voltage (the input voltage when the board is turn off from power jack):
  V_out_off = 5.3V; V_ref = 2.495V
  V_out_off = V_ref * (1 + R292 / R296) = 2.495 * (1 + 11.8k / 10.5k) = 5.299V
- DESIGN NOTE:
  Be aware: When minimum input voltage is applied (e.g. under 3V) and maximum current is drawn (over 7A), some parameters of transistor Q7 (e.g. drain current or voltage threeshold) may be on its limits.
- User Button
- DESIGN NOTE:
  Chip U27 is a shunt regulator and is used to control the overvoltage protection.
  When the voltage on divider R292-R296 is below internal reference (+V_INPUT is lower then 5.3V), then input voltage is connected to system input power.
  If +V_INPUT is above +5.3V, transistor Q7 is turn off to prevent the board from damaging.
- Power Input / Output Header
- DESIGN NOTE:
  Input voltage (+V_INPUT): +3.2-5.3V
  (Required max. 10A)
- DESIGN NOTE:
  Power header J8 can be used as an ouptut connector for supplying external devices (e.g. 2.5'' hard drive or fan). Be sure that +V_INPUT is within the device voltage specification.
  Power header J8 can also supply the whole board when input jack is not fitted.
- LEDs
- DESIGN NOTE:
  Maximum current per contact: 4A
- Power & User LEDs
- DESIGN NOTE:
  If all powers are ok, power led is on.
- Mechanical
- Mounting Holes
- Mounting holes 7.4mm pad 3.2mm drill
- BOARD MOUNTING HOLES
- ONE IN EACH CORNER
- MODULE MOUNTING HOLES
- Mounting holes 5mm pad 2mm drill
- HEATSINK MOUNTING HOLES
- Mounting holes 5.2mm pad 2.7mm drill
- PCB
- iMX6 TinyRex Module
- Module Mounting Accessories
- Fiducials
- Gnd Testpoint
- 3D Model
- Free for personal and commercial use.
- FIDICIALS 4x TOP
- FIDICIALS 4x BOTTOM
- Variant:
- Checked by
- (in symbol 2N7002BKW,115) D; G; S
- (in symbol PCB_iMX6_TinyRex_Baseboard_Lite_V1I1) PCB
- (in symbol SDTitleBlock) Title:; Page Contents:; Revision:; Size:; DWG NO; Date:; Sheet; of
- (in symbol TL431AQDBZR) C; A

### Library data of the parts
C10 = C1608X5R0J106M: as C91 on sheet [14] - PWR 5V, 3V3, 2V5; Category: Capacitors; Supplier Part Number: 445-4112-1-ND; Manufacturer Part Number: C1608X5R0J106M; Operating Temperature: -55°C ~ 85°C; Package / Case: 0603 (1608 Metric); Price 1k [$]: 0.08580; .Checked SCH: used; Voltage - Rated: 6.3V; Features: Low ESR; Supplier: Digikey; Supplier 1: Digi-Key; Supplier Part Number 1: 445-4112-1-ND; RoHS: RoHS Compliant; Stock 1: 48157; Pricing 1: 1=0.46, 10=0.363, 100=0.1898, 250=0.14024, 500=0.1089, 1000=0.0858 (USD); Tolerance: ±20%; Temperature Coefficient: X5R; Mounting Type: Surface Mount, MLCC; Applications: General Purpose; Ratings: -; Size / Dimension: 0.063" L x 0.031" W (1.60mm x 0.80mm); Height - Seated (Max): -; Thickness (Max): 0.037" (0.95mm); Lead Spacing: -; Packaging: Cut Tape (CT); Lead Style: -; ComponentLink1URL: http://www.tdk.com/pdf/general_B11.pdf; ComponentLink1Description: http://www.tdk.com/pdf/general_B11.pdf
C79 C198 C200 = C1005X5R1H104K: as C26 on sheet [09] - USB; Category: Capacitors; Supplier Part Number: 445-5942-1-ND; Manufacturer Part Number: C1005X5R1H104K; Operating Temperature: -55°C ~ 85°C; Package / Case: 0402 (1005 Metric); Price 1k [$]: 0.02340; .Checked SCH: used; Voltage - Rated: 50V; Supplier: Digikey; Supplier 1: Digi-Key; Supplier Part Number 1: 445-5942-1-ND; RoHS: RoHS Compliant; Stock 1: 106926; Pricing 1: 1=0.27, 10=0.18, 100=0.072, 250=0.05176, 500=0.0369, 1000=0.027 (USD); Tolerance: ±10%; Temperature Coefficient: X5R; Mounting Type: Surface Mount, MLCC; Applications: General Purpose; Ratings: -; Size / Dimension: 0.039" L x 0.020" W (1.00mm x 0.50mm); Height - Seated (Max): -; Thickness (Max): 0.022" (0.55mm); Lead Spacing: -; Features: -; Packaging: Cut Tape (CT); Lead Style: -; ComponentLink1URL: http://www.tdk.co.jp/tefe02/e412_c.pdf; ComponentLink1Description: http://www.tdk.co.jp/tefe02/e412_c.pdf
C381 = C1608X5R0J226M080AC: as C29 on sheet [14] - PWR 5V, 3V3, 2V5; Supplier 1: Digi-Key; Manufacturer Part Number: C1608X5R0J226M080AC; RoHS: RoHS Compliant; Category: Capacitors; Stock 1: 593047; Pricing 1: 1=0.39, 10=0.343, 100=0.1714, 250=0.13708, 500=0.12484, 1000=0.1104 (USD); Packaging: Cut Tape (CT); Tolerance: ±20%; Voltage - Rated: 6.3V; Temperature Coefficient: X5R; Mounting Type: Surface Mount, MLCC; Operating Temperature: -55°C ~ 85°C; Applications: General Purpose; Ratings: -; Package / Case: 0603 (1608 Metric); Size / Dimension: 0.063" L x 0.031" W (1.60mm x 0.80mm); Height - Seated (Max): -; Thickness (Max): 0.039" (1.00mm); Lead Spacing: -; Features: -; Lead Style: -; ComponentLink1URL: http://product.tdk.com/en/catalog/datasheets/mlcc_commercial_general_en.pdf; ComponentLink1Description: http://product.tdk.com/en/catalog/datasheets/mlcc_commercial_general_en.pdf; Supplier Part Number 1: 445-8028-1-ND; .Checked PCB: MM; .Checked SCH: MM
D1 = SS10P4-M3/86A: DIODE SCHOTTKY 40V 10A TO277A; Manufacturer: Vishay Semiconductor Diodes Division; Voltage - Forward (Vf) (Max) @ If: 560mV @ 10A; Speed: Fast Recovery =< 500ns, > 200mA (Io); Current - Reverse Leakage @ Vr: 800µA @ 40V; Capacitance @ Vr, F: 750pF @ 4V, 1MHz; .Checked PCB: MM; Supplier 1: Digi-Key; Manufacturer Part Number: SS10P4-M3/86A; RoHS: RoHS Compliant; Category: Discrete Semiconductor Products; Stock 1: 18662; Pricing 1: 1=0.91, 10=0.796, 25=0.7032, 100=0.613, 250=0.5336, 500=0.45424 (USD); Packaging: Cut Tape (CT); Diode Type: Schottky; Voltage - DC Reverse (Vr) (Max): 40V; Current - Average Rectified (Io): 10A; Reverse Recovery Time (trr): -; Mounting Type: Surface Mount; Package / Case: TO-277, 3-PowerDFN; Supplier Device Package: TO-277A (SMPC); Operating Temperature - Junction: -55°C ~ 150°C; ComponentLink1URL: http://www.vishay.com/docs/88983/ss10p4.pdf; ComponentLink1Description: http://www.vishay.com/docs/88983/ss10p4.pdf; Supplier Part Number 1: SS10P4-M3/86AGICT-ND; .Checked SCH: MM; .Creator: MM
D5 = LS L29K-H1J2-1-Z: LED SMARTLED RED 630NM 0603 SMD; Manufacturer: OSRAM Opto Semiconductors Inc; Millicandela Rating: 4.95mcd; Voltage - Forward (Vf) Typ: 1.8V; Current - Test: 2mA; Wavelength - Peak: 643nm; Viewing Angle: 160°; Lens Type: Diffused; Lens Style/Size: Rectangle with Flat Top, 1.3mm x 0.8mm; Luminous Flux @ Current - Test: 20 mlm; .Checked PCB: used; Supplier 1: Digi-Key; Supplier Part Number 1: 475-1195-1-ND; Manufacturer Part Number: LS L29K-H1J2-1-Z; RoHS: RoHS Compliant; Category: Optoelectronics; Stock 1: 71670; Pricing 1: 1=0.16, 10=0.137, 100=0.1093, 250=0.09564, 500=0.08744 (USD); Color: Red; Wavelength - Dominant: 630nm; Package / Case: 0603 (1608 Metric); Size / Dimension: 1.70mm L x 0.80mm W; Height: 0.65mm; Mounting Type: Surface Mount; Packaging: Cut Tape (CT); ComponentLink1URL: http://catalog.osram-os.com/catalogue/catalogue.do;jsessionid=DB7CFDBAC5AF1E216E45F622E867085A?act=downloadFile&favOid=020000010003f9de000100b6; ComponentLink1Description: http://catalog.osram-os.com/catalogue/catalogue.do;jsessionid=DB7CFDBAC5AF1E216E45F622E867085A?act=downloadFile&favOid=020000010003f9de000100b6; .Checked SCH: used
D14 = LG L29K-G2J1-24-Z: LED SMARTLED GREEN 570NM 0603; Manufacturer: OSRAM Opto Semiconductors Inc; .Checked PCB: used; Current - Test: 2mA; Voltage - Forward (Vf) Typ: 1.7V; Luminous Flux @ Current - Test: 12 mlm; Millicandela Rating: 3.92mcd; Wavelength - Peak: 572nm; Lens Type: Diffused; Lens Style/Size: Rectangle with Flat Top, 1.3mm x 0.8mm; Viewing Angle: 160°; Regulator Topology: Positive Fixed; Voltage - Output: 2.5V; Voltage - Input: 2.6 V ~ 6 V; Voltage - Dropout (Typical): 0.16V @ 500mA; Number of Regulators: 1; Current - Output: 500mA; Current - Limit (Min): 600mA; .Checked SCH: used; Category: Optoelectronics; Family: LEDs - <75mA, Discre; Manufacturer Part Number: LG L29K-G2J1-24-Z; Price 1k [$]: 0.08744; Value: Green; Color: Green; Package / Case: 0603 (1608 Metric); Supplier Part Number: 475-2709-1-ND; Supplier: Digikey; Supplier 1: Digi-Key; Supplier Part Number 1: 475-2709-1-ND; RoHS: RoHS Compliant; Stock 1: 30318; Pricing 1: 1=0.16, 10=0.137, 100=0.1093, 250=0.09564, 500=0.08744 (USD); Wavelength - Dominant: 570nm; Size / Dimension: 1.70mm L x 0.80mm W; Height: 0.65mm; Mounting Type: Surface Mount; Packaging: Cut Tape (CT); ComponentLink1URL: http://catalog.osram-os.com/catalogue/catalogue.do;jsessionid=32CB61882C089EDD4B6D0A54E7E1F117?act=downloadFile&favOid=020000020000138e000100b6; ComponentLink1Description: http://catalog.osram-os.com/catalogue/catalogue.do;jsessionid=32CB61882C089EDD4B6D0A54E7E1F117?act=downloadFile&favOid=020000020000138e000100b6; Operating Temperature: -40°C ~ 125°C; Supplier Device Package: 6-TMLF® (1.6x1.6); ComponentLink2URL: http://www.micrel.com/_PDF/mic5353.pdf; ComponentLink2Description: http://www.micrel.com/_PDF/mic5353.pdf
FID1-FID8 = FID_1MMC: Fiducial 40mil Diameter, 120mil Mask; Supplier: Digikey
J8 = 0022112022: CONN HEADER 2POS .100 VERT GOLD; Manufacturer: Molex, LLC; Connector Type: Header, Unshrouded; Number of Positions: 2; Number of Positions Loaded: All; Pitch: 0.100" (2.54mm); .Creator: MM; .Checked PCB: MM, paper model not checked; Supplier 1: Digi-Key; Manufacturer Part Number: 0022112022; RoHS: RoHS Compliant; Category: Connectors, Interconnects; Stock 1: 30346; Pricing 1: 1=0.38, 10=0.362, 25=0.3104, 50=0.2636, 100=0.2533, 250=0.22748, 500=0.21714, 1000=0.18095, 2500=0.16544 (USD); Packaging: Bulk; Contact Type: Male Pin; Number of Rows: 1; Row Spacing: -; Contact Mating Length: 0.295" (7.49mm); Mounting Type: Through Hole; Termination: Solder; Fastening Type: Friction Lock; Features: -; Contact Finish: Gold; Contact Finish Thickness: 20µin (0.51µm); Color: White; ComponentLink1URL: http://www.molex.com/pdm_docs/sd/022112022_sd.pdf; ComponentLink1Description: http://www.molex.com/pdm_docs/sd/022112022_sd.pdf; Supplier Part Number 1: WM2700-ND; .Checked SCH: MM
M1 = 3D_iMX6_TINYREX_MODULE_V1I1: 3D Model; .Creator: MM; Category: 3D Model
MH1-MH4 = MH_7.4MMC_3.2MMD: Mounting Hole 7.4mm Diameter, 3.2mm Drill; .Creator: MM
MH5 MH6 = MH_5MMC_2MMD: Mounting Hole 5mm Diameter, 2mm Drill; .Creator: MM
MH11 MH12 = MH_5.2MMC_2.7MMD: Mounting Hole 5.2mm Diameter, 2.7mm Drill; .Creator: MM
NUT3 NUT4 = PFP1166: ROEBUCK - PFP1166 - FULL NUT A4 SS M2 (PK 100); Fastener Material: Stainless Steel; .Checked SCH: MM; Category: Hardware, Fasteners, Accessories; Family: Nuts; Manufacturer: ROEBUCK; Manufacturer Part Number: PFP1166; Price 1k [$]: 0.04; Supplier: Farnell; Supplier Part Number: 1552206; Value: M2; Type: Hex; Thread Size: M2; Supplier 1: Farnell; Supplier Part Number 1: 1552206; RoHS: TBA; Stock 1: 19; Pricing 1: 100=0.0624, 500=0.0551, 1000=0.0498, 2500=0.046 (EUR); Thread Size - Metric: M2; Material: Stainless Steel; ComponentLink1URL: http://www.farnell.com/datasheets/1511479.pdf; ComponentLink1Description: http://www.farnell.com/datasheets/1511479.pdf
PCB1 = PCB_iMX6_TinyRex_Baseboard_Lite_V1I1: .Creator: MM; Category: Printed circuits board; .Checked SCH: MM
Q4 Q5 = 2N7002BKW,115: as Q3 on sheet [11] - SD CARD, BUFFERS; Supplier 1: Digi-Key; Supplier Part Number 1: 568-5980-1-ND; Manufacturer Part Number: 2N7002BKW,115; RoHS: RoHS Compliant; Category: Discrete Semiconductor Products; Stock 1: 15666; Pricing 1: 1=0.39, 10=0.354, 25=0.2548, 100=0.1983, 250=0.12456, 500=0.10616, 1000=0.07233 (USD); Drain to Source Voltage (Vdss): 60V; Current - Continuous Drain (Id) @ 25° C: 310mA; Mounting Type: Surface Mount; Package / Case: SC-70, SOT-323; Supplier Device Package: SC-70; Packaging: Cut Tape (CT); ComponentLink1URL: http://www.nxp.com/documents/data_sheet/2N7002BKW.pdf; ComponentLink1Description: http://www.nxp.com/documents/data_sheet/2N7002BKW.pdf; .Checked SCH: used
Q7 = SI4425BDY-T1-E3: MOSFET P-CH 30V 8.8A 8-SOIC; Manufacturer: Vishay Siliconix; FET Type: MOSFET P-Channel, Metal Oxide; FET Feature: Logic Level Gate; Current - Continuous Drain (Id) @ 25°C: 8.8A (Ta); Rds On (Max) @ Id, Vgs: 12 mOhm @ 11.4A, 10V; Vgs(th) (Max) @ Id: 3V @ 250µA; Gate Charge (Qg) @ Vgs: 100nC @ 10V; Power - Max: 1.5W; .Checked PCB: MM; Supplier 1: Digi-Key; Manufacturer Part Number: SI4425BDY-T1-E3; RoHS: RoHS Compliant; Category: Discrete Semiconductor Products; Stock 1: 26582; Pricing 1: 1=1, 10=0.88, 25=0.7948, 100=0.6955, 250=0.60996, 500=0.54096, 1000=0.4278 (USD); Packaging: Cut Tape (CT); Drain to Source Voltage (Vdss): 30V; Input Capacitance (Ciss) @ Vds: -; Mounting Type: Surface Mount; Package / Case: 8-SOIC (0.154", 3.90mm Width); Supplier Device Package: 8-SO; ComponentLink1URL: http://www.vishay.com/docs/72000/72000.pdf; ComponentLink1Description: http://www.vishay.com/docs/72000/72000.pdf; Supplier Part Number 1: SI4425BDY-T1-E3CT-ND; .Checked SCH: MM; .Creator: MM
Q10 = MMBT3906,215: TRANS PNP 40V 0.2A SOT23; Manufacturer: NXP Semiconductors; Current - Collector (Ic) (Max): 200mA; Vce Saturation (Max) @ Ib, Ic: 400mV @ 5mA, 50mA; DC Current Gain (hFE) (Min) @ Ic, Vce: 100 @ 10mA, 1V; Power - Max: 250mW; Frequency - Transition: 250MHz; .Checked PCB: MM; Supplier 1: Digi-Key; Manufacturer Part Number: MMBT3906,215; RoHS: RoHS Compliant; Category: Discrete Semiconductor Products; Stock 1: 39823; Pricing 1: 1=0.14, 10=0.125, 25=0.1132, 100=0.0816, 250=0.04804, 500=0.03986, 1000=0.02719 (USD); Packaging: Cut Tape (CT); Transistor Type: PNP; Voltage - Collector Emitter Breakdown (Max): 40V; Current - Collector Cutoff (Max): -; Mounting Type: Surface Mount; Package / Case: TO-236-3, SC-59, SOT-23-3; Supplier Device Package: SOT-23 (TO-236AB); ComponentLink1URL: http://www.nxp.com/documents/data_sheet/MMBT3906.pdf; ComponentLink1Description: http://www.nxp.com/documents/data_sheet/MMBT3906.pdf; Supplier Part Number 1: 568-4511-1-ND; .Checked SCH: MM; .Creator: MM
R100 = RNCP1206FTD1K00: RES SMD 1K OHM 1% 1/2W 1206; Manufacturer: Stackpole Electronics Inc; Power (Watts): 0.5W, 1/2W; Temperature Coefficient: ±100ppm/°C; .Checked PCB: MM; Supplier 1: Digi-Key; Manufacturer Part Number: RNCP1206FTD1K00; RoHS: RoHS Compliant; Category: Resistors; Stock 1: 120283; Pricing 1: 1=0.1, 10=0.065, 50=0.0356, 100=0.0271, 250=0.02016, 500=0.01488, 1000=0.00992, 2500=0.00837 (USD); Packaging: Cut Tape (CT); Resistance (Ohms): 1k; Tolerance: ±1%; Composition: Thin Film; Features: Anti-Sulfur; Operating Temperature: -55°C ~ 155°C; Package / Case: 1206 (3216 Metric); Supplier Device Package: 1206; Size / Dimension: 0.122" L x 0.059" W (3.10mm x 1.50mm); Height: 0.024" (0.60mm); Number of Terminations: 2; ComponentLink1URL: http://www.seielect.com/catalog/SEI-RNCP.pdf; ComponentLink1Description: http://www.seielect.com/catalog/SEI-RNCP.pdf; Supplier Part Number 1: RNCP1206FTD1K00CT-ND; .Checked SCH: MM; .Creator: MM
R140 R147 R293 = RC0402FR-0710KL: as R45 on sheet [09] - USB; Category: Resistors; Supplier Part Number: 311-10.0KLRCT-ND; Manufacturer Part Number: RC0402FR-0710KL; Package / Case: 0402 (1005 Metric); Price 1k [$]: 0.01421; Resistance (Ohms): 10K; Tolerance: ±1%; Value: 10k; .Checked SCH: used; Supplier: Digikey; Supplier 1: Digi-Key; Supplier Part Number 1: 311-10.0KLRCT-ND; RoHS: RoHS Compliant; Stock 1: 2916495; Pricing 1: 10=0.014, 50=0.0104, 100=0.0079, 250=0.00584, 500=0.00432, 1000=0.00288 (USD); Composition: Thick Film; Features: -; Size / Dimension: 0.039" L x 0.020" W (1.00mm x 0.50mm); Height: 0.016" (0.40mm); Number of Terminations: 2; Packaging: Cut Tape (CT); ComponentLink1URL: http://www.yageo.com/documents/recent/PYu-RC0402_51_RoHS_L_6.pdf; ComponentLink1Description: http://www.yageo.com/documents/recent/PYu-RC0402_51_RoHS_L_6.pdf
R141 R149 = RMCF0402FT33R0: RES TF 33 OHM 1% 1/16W 0402; Manufacturer: Stackpole Electronics Inc; Resistance (Ohms): 33; Power (Watts): 0.063W, 1/16W; .Checked PCB: used; Temperature Coefficient: ±100ppm/°C; Category: Resistors; Supplier Part Number: RMCF0402FT33R0CT-ND; Manufacturer Part Number: RMCF0402FT33R0; Package / Case: 0402 (1005 Metric); Price 1k [$]: 0.00384; Tolerance: ±1%; Value: 33R; .Checked SCH: used; Supplier: Digikey; Supplier 1: Digi-Key; Supplier Part Number 1: RMCF0402FT33R0CT-ND; RoHS: RoHS Compliant; Stock 1: 26866; Pricing 1: 1=0.04, 10=0.025, 50=0.0138, 100=0.0105, 250=0.0078, 500=0.00576, 1000=0.00384 (USD); Composition: Thick Film; Features: -; Size / Dimension: 0.039" L x 0.020" W (1.00mm x 0.50mm); Height: 0.016" (0.40mm); Number of Terminations: 2; Packaging: Cut Tape (CT); ComponentLink1URL: http://www.seielect.com/Catalog/SEI-RMCF.pdf; ComponentLink1Description: http://www.seielect.com/Catalog/SEI-RMCF.pdf
R144-R146 R148 = RMCF0402FT240R: RES TF 240 OHM 1% 0.0625W 0402; Manufacturer: Stackpole Electronics Inc; Resistance (Ohms): 240; Power (Watts): 0.063W, 1/16W; .Checked PCB: used; Temperature Coefficient: ±100ppm/°C; Category: Resistors; Supplier Part Number: RMCF0402FT240RCT-ND; Manufacturer Part Number: RMCF0402FT240R; Package / Case: 0402 (1005 Metric); Price 1k [$]: 0.00384; Tolerance: ±1%; Value: 240R; .Checked SCH: used; Supplier: Digikey; Supplier 1: Digi-Key; Supplier Part Number 1: RMCF0402FT240RCT-ND; RoHS: RoHS Compliant; Stock 1: 39860; Pricing 1: 1=0.04, 10=0.025, 50=0.0138, 100=0.0105, 250=0.0078, 500=0.00576, 1000=0.00384 (USD); Composition: Thick Film; Features: -; Size / Dimension: 0.039" L x 0.020" W (1.00mm x 0.50mm); Height: 0.016" (0.40mm); Number of Terminations: 2; Packaging: Cut Tape (CT); ComponentLink1URL: http://www.seielect.com/Catalog/SEI-RMCF.pdf; ComponentLink1Description: http://www.seielect.com/Catalog/SEI-RMCF.pdf
R292 = CRCW040211K8FKED: RES 11.8K OHM 1/16W 1% 0402 SMD; Manufacturer: Vishay Dale; Power (Watts): 0.063W, 1/16W; Temperature Coefficient: ±100ppm/°C; .Checked PCB: RF; Supplier 1: Digi-Key; Supplier Part Number 1: 541-11.8KLCT-ND; Manufacturer Part Number: CRCW040211K8FKED; RoHS: RoHS Compliant; Category: Resistors; Stock 1: 30358; Pricing 1: 10=0.083, 50=0.0444, 200=0.0255, 1000=0.0174 (USD); Resistance (Ohms): 11.8K; Composition: Thick Film; Features: -; Tolerance: ±1%; Package / Case: 0402 (1005 Metric); Size / Dimension: 0.039" L x 0.020" W (1.00mm x 0.50mm); Height: 0.016" (0.40mm); Number of Terminations: 2; Packaging: Cut Tape (CT); ComponentLink1URL: http://www.vishay.com/doc?20035; ComponentLink1Description: http://www.vishay.com/doc?20035; .Checked SCH: RF
R296 = CRCW040210K5FKED: RES 10.5K OHM 1/16W 1% 0402 SMD; Manufacturer: Vishay/Dale; Power (Watts): 0.063W, 1/16W; .Checked PCB: used; Temperature Coefficient: ±100ppm/°C; Category: Resistors; Supplier Part Number: 541-10.5KLCT-ND; Manufacturer Part Number: CRCW040210K5FKED; Package / Case: 0402 (1005 Metric); Price 1k [$]: 0.01740; Resistance (Ohms): 10.5K; Tolerance: ±1%; Value: 10k5; .Checked SCH: used; Supplier: Digikey; Supplier 1: Digi-Key; Supplier Part Number 1: 541-10.5KLCT-ND; RoHS: RoHS Compliant; Stock 1: 36157; Pricing 1: 10=0.083, 50=0.0444, 200=0.0255, 1000=0.0174 (USD); Composition: Thick Film; Features: -; Size / Dimension: 0.039" L x 0.020" W (1.00mm x 0.50mm); Height: 0.016" (0.40mm); Number of Terminations: 2; Packaging: Cut Tape (CT); ComponentLink1URL: http://www.vishay.com/doc?20035; ComponentLink1Description: http://www.vishay.com/doc?20035
R301 = CRCW0402470KFKED: RES 470K OHM 1/16W 1% 0402 SMD; Manufacturer: Vishay Dale; Power (Watts): 0.063W, 1/16W; Temperature Coefficient: ±100ppm/°C; .Checked PCB: MM; Supplier 1: Digi-Key; Supplier Part Number 1: 541-470KLCT-ND; Manufacturer Part Number: CRCW0402470KFKED; RoHS: RoHS Compliant; Category: Resistors; Stock 1: 9270; Pricing 1: 10=0.083, 50=0.0444, 200=0.0255, 1000=0.0174 (USD); Resistance (Ohms): 470K; Composition: Thick Film; Features: -; Tolerance: ±1%; Size / Dimension: 0.039" L x 0.020" W (1.00mm x 0.50mm); Height: 0.016" (0.40mm); Number of Terminations: 2; Packaging: Cut Tape (CT); Package / Case: 0402 (1005 Metric); ComponentLink1URL: http://www.vishay.com/doc?20035; ComponentLink1Description: http://www.vishay.com/doc?20035; .Checked SCH: MM
S600 S601 = SWITCH-MOMENTARY-2: Supplier 1: Digi-Key
SCR3 SCR4 = MPMS 002 0008 PH: MACHINE SCREW PAN PHILLIPS M2; Manufacturer: B&F Fastener Supply; Screw Head Type: Pan Head; Head Diameter: 0.152" (3.85mm); Head Height: 0.060" (1.52mm); Plating: Zinc; .Creator: MM; Supplier 1: Digi-Key; Manufacturer Part Number: MPMS 002 0008 PH; RoHS: RoHS Compliant; Category: Hardware, Fasteners, Accessories; Stock 1: 74600; Pricing 1: 100=0.0705, 1000=0.0564 (USD); Type: Machine Screw; Drive Type: Phillips; Features: -; Thread Size: M2; Length - Below Head: 0.315" (8.00mm); Length - Overall: 0.375" (9.53mm) 3/8"; Material: -; ComponentLink1URL: http://www.fasnetdirect.com/refguide/MetD7985a.pdf; ComponentLink1Description: http://www.fasnetdirect.com/refguide/MetD7985a.pdf; Supplier Part Number 1: H739-ND; .Checked SCH: MM
SPA3 SPA4 = SPACER 2.5/4.5X1.5MM: .Creator: MM; Category: Spacer; .Checked SCH: MM
TP9 TP10 = TP_25MILC: Test Point 25mil
U27 = TL431AQDBZR: IC VREF SHUNT ADJ SOT23-3; Manufacturer: Texas Instruments; Output Type: Adjustable; Voltage - Output (Min/Fixed): 2.495V; Voltage - Output (Max): 36V; Current - Output: 100mA; Tolerance: ±1%; Current - Cathode: 700µA; .Checked PCB: MM; Supplier 1: Digi-Key; Manufacturer Part Number: TL431AQDBZR; RoHS: RoHS Compliant; Category: Integrated Circuits (ICs); Stock 1: 14090; Pricing 1: 1=0.48, 10=0.323, 100=0.151, 1000=0.131 (USD); Packaging: Cut Tape (CT); Reference Type: Shunt; Temperature Coefficient: -; Noise - 0.1Hz to 10Hz: -; Noise - 10Hz to 10kHz: -; Voltage - Input: -; Current - Supply: -; Operating Temperature: -40°C ~ 125°C (TA); Mounting Type: Surface Mount; Package / Case: TO-236-3, SC-59, SOT-23-3; Supplier Device Package: SOT-23-3; ComponentLink1URL: http://www.ti.com/lit/ds/symlink/tl431a.pdf; ComponentLink1Description: http://www.ti.com/lit/ds/symlink/tl431a.pdf; Supplier Part Number 1: 296-18864-1-ND; .Checked SCH: MM; .Creator: MM

## Sheet [16] - CAN BUS.SchDoc: CAN Tranceiver
size A4; DrawnBy: Dale Matthews; Revision: V1I1; SheetNumber: 1; SheetTotal: 1
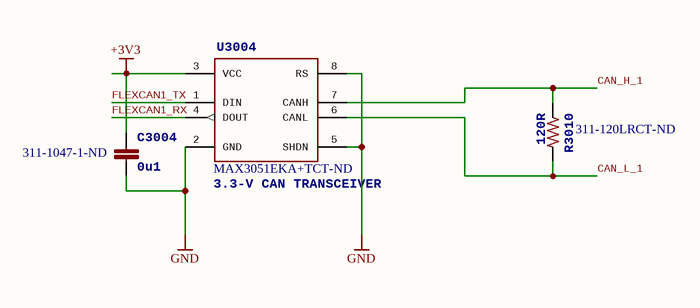
[diagram p19: [16] - CAN BUS.SchDoc]

### Parts
C3004  0u1  Supplier Part Number 1: 311-1047-1-ND  [0402-CAP]
R3010  120R  Supplier Part Number 1: 311-120LRCT-ND  [0402-RES]
U3004  3.3-V CAN TRANSCEIVER  Supplier Part Number 1: MAX3051EKA+TCT-ND  [SOT23-8]

### Nets
+3V3: C3004.P$1 U3004.3(VCC)
GND: C3004.P$2 U3004.2(GND) U3004.5(SHDN) U3004.8(RS)
CAN_H_1: R3010.P$1 U3004.7(CANH)
CAN_L_1: R3010.P$2 U3004.6(CANL)
FLEXCAN1_RX: U3004.4(DOUT)
FLEXCAN1_TX: U3004.1(DIN)

### Library data of the parts
C3004 = CAP0402: CAP CER 0.1UF 16V Y5V 0402; PARTNO: CC0402ZRY5V7BB104; 3DR_PARTNO: ECM0700; Supplier 1: Digi-Key; Value: 0u1
R3010 = RESISTOR0402-RES: RES 120 OHM 1/16W 1% 0402 SMD; PARTNO: RC0402FR-07120RL; 3DR_PARTNO: ECM0820; Supplier 1: Digi-Key; Value: 120R
U3004 = MAX3051MAX3051EKA: IC TXRX CAN 1MBPS SOT23-8; 3DR_PARTNO: ECM0831; PARTNO: MAX3051EKA+T; Supplier 1: Digi-Key; Value: CAN